# Altium schematic sheet 3_接口.schdoc.schdoc
size 309 x 223 mm; Symbol: Sheet-Symbol_A4; Device: Sheet-Symbol_A4; Company: 嘉立创EDA; Drawed: 吴登珂; Version: V1.0; Page Size: A4; @Project Name: 最小系统板; @Page Count: 3; @Update Date: 2024-04-14; @Create Date: 2024-04-05; @Schematic Name: Schematic1; @Page No: 2; @Page Name: 接口
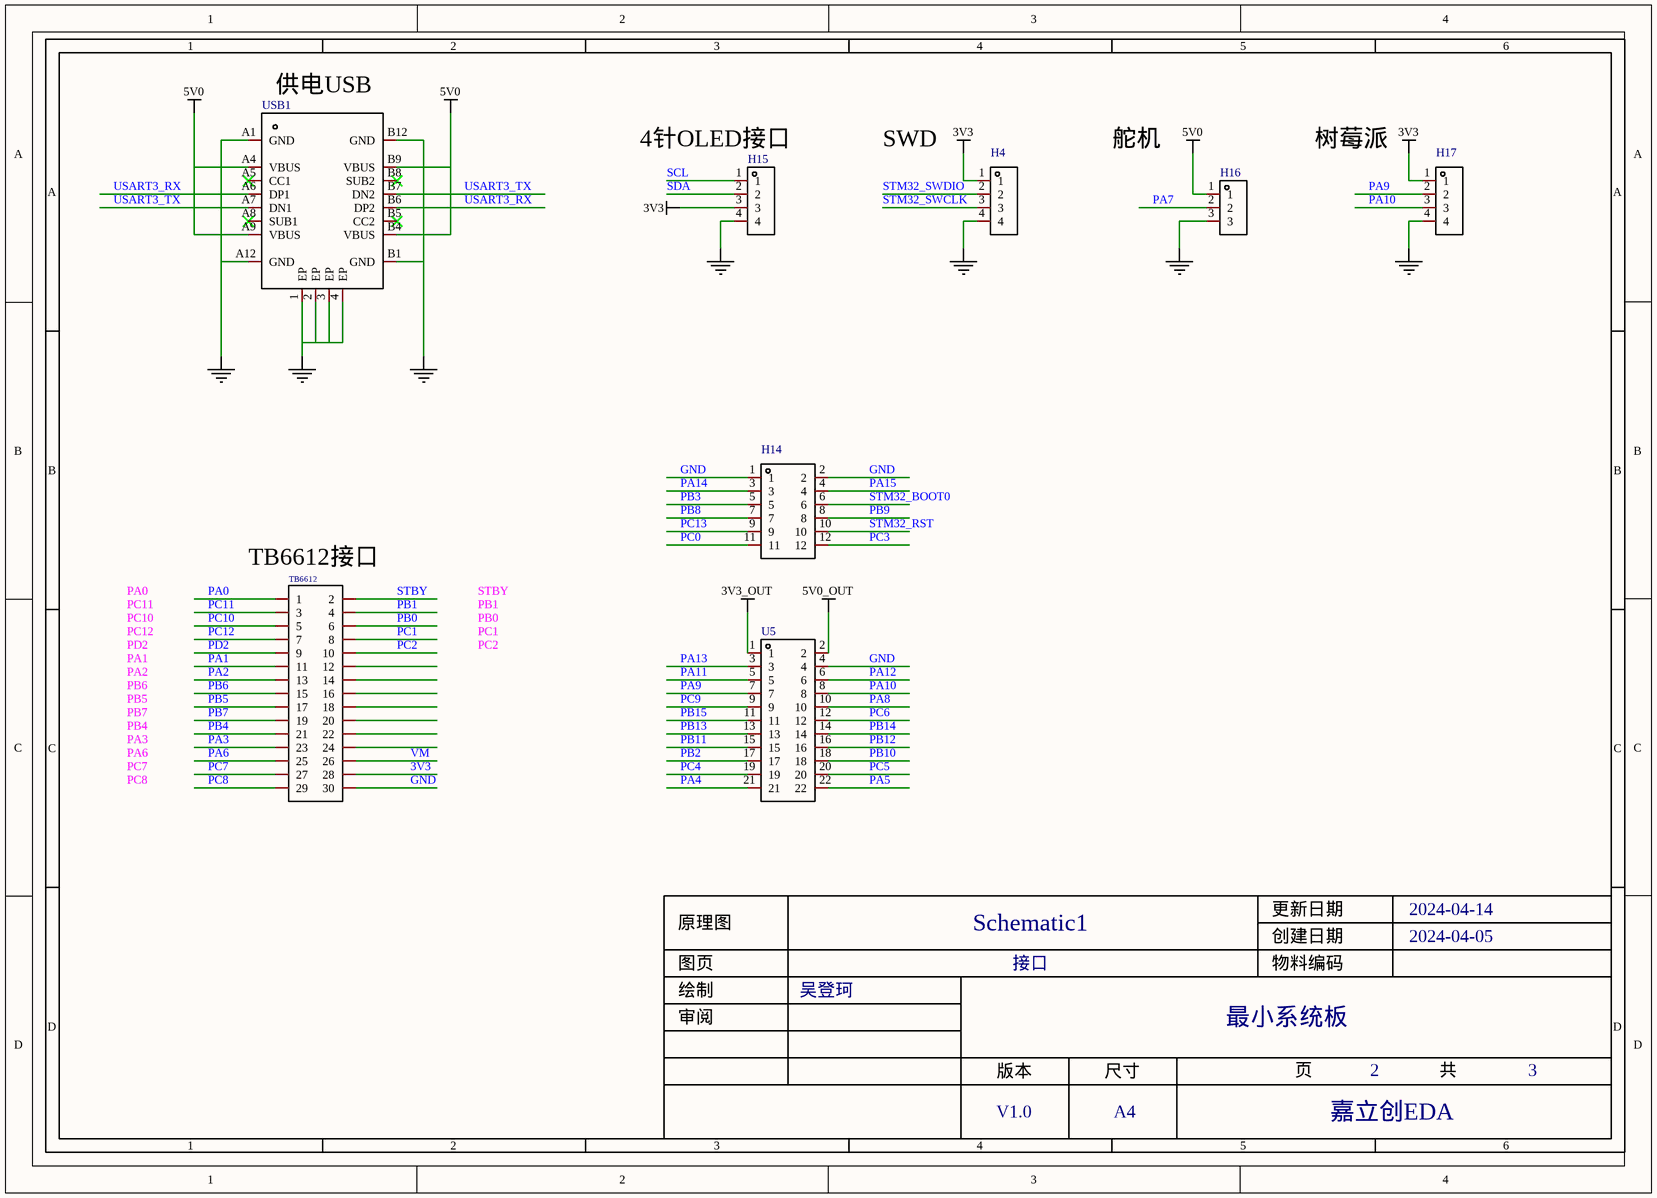
[diagram p0: 3_接口.schdoc.schdoc]

## Parts
H4  PZ254V-11-04P  [HDR-TH_4P-P2.54-V-M]  (value not drawn)
H14  HDR-M_2.54_2x6  [HDR-TH_12P-P2.54-V-M-R2-C6-S2.54]  (value not drawn)
H15  HDR-M_2.54_1x4P  [HDR-TH_4P-P2.54-V-M]  (value not drawn)
H16  HDR-F_2.54_1x3P  [HDR-TH_3P-P2.54-V-F]  (value not drawn)
H17  HDR-F_2.54_1x4P  [HDR-TH_4P-P2.54-V-F]  (value not drawn)
TB6612  2.54-2*15P双排针  [HDR-TH_30P-P2.54-V-M-R2-C15-S2.54]  (value not drawn)
U5  PM254-2-11-Z-8.5  [HDR-TH_22P-P2.54-V-F-R2-C11-S2.54]  (value not drawn)
USB1  KH-TYPE-C-16P  [USB-C-SMD_KH-TYPE-C-16P]  (value not drawn)

## Nets
3V3: H4.1 H15.3 H17.1 TB6612.28
3V3_OUT: U5.1
5V0: H16.1 USB1.A4(VBUS) USB1.A9(VBUS) USB1.B4(VBUS) USB1.B9(VBUS)
5V0_OUT: U5.2
NetH4_4: H4.4 H15.4 H16.3 H17.4 USB1.1(EP) USB1.2(EP) USB1.3(EP) USB1.4(EP) USB1.A1(GND) USB1.A12(GND) USB1.B1(GND) USB1.B12(GND)
GND: H14.1 H14.2 TB6612.30 U5.4
PA0: TB6612.1
PA1: TB6612.11
PA2: TB6612.13
PA3: TB6612.23
PA4: U5.21
PA5: U5.22
PA6: TB6612.25
PA7: H16.2
PA8: U5.10
PA9: H17.2 U5.7
PA10: H17.3 U5.8
PA11: U5.5
PA12: U5.6
PA13: U5.3
PA14: H14.3
PA15: H14.4
PB0: TB6612.6
PB1: TB6612.4
PB2: U5.17
PB3: H14.5
PB4: TB6612.21
PB5: TB6612.17
PB6: TB6612.15
PB7: TB6612.19
PB8: H14.7
PB9: H14.8
PB10: U5.18
PB11: U5.15
PB12: U5.16
PB13: U5.13
PB14: U5.14
PB15: U5.11
PC0: H14.11
PC1: TB6612.8
PC2: TB6612.10
PC3: H14.12
PC4: U5.19
PC5: U5.20
PC6: U5.12
PC7: TB6612.27
PC8: TB6612.29
PC9: U5.9
PC10: TB6612.5
PC11: TB6612.3
PC12: TB6612.7
PC13: H14.9
PD2: TB6612.9
SCL: H15.1
SDA: H15.2
STBY: TB6612.2
STM32_BOOT0: H14.6
STM32_RST: H14.10
STM32_SWCLK: H4.3
STM32_SWDIO: H4.2
USART3_RX: USB1.A6(DP1) USB1.B6(DP2)
USART3_TX: USB1.A7(DN1) USB1.B7(DN2)
VM: TB6612.26

Not connected (* = marked no-connect by the designer): TB6612 12 14 16 18 20 22 24; USB1 A5(CC1)* A8(SUB1)* B5(CC2)* B8(SUB2)*

## Notes on the sheet
- (near USB1) 供电USB
- (near H15) 4针OLED接口
- SWD
- 舵机
- 树莓派
- PA0
- PC11
- (near TB6612) TB6612接口
- PB1
- STBY
- PA1
- PA2
- PC10
- PC12
- PD2
- PB0
- PC1
- PC2
- PA3
- PB5
- PB6
- PB7
- PB4
- PA6
- PC7
- PC8
- 1
- 2
- 3
- 4
- 5
- 6
- A
- B
- C
- 原理图
- Schematic1
- 创建日期
- 更新日期
- 2024-04-14
- 2024-04-05
- 审阅
- 绘制
- 图页
- 吴登珂
- 接口
- 物料编码
- 最小系统板
- D
- 版本
- 尺寸
- 页
- 共
- V1.0
- A4
- 嘉立创EDA

## Library data of the parts
H4 = PZ254V-11-04P: Manufacturer: XFCN(兴飞); Symbol: PZ254V-11-04P_C2691448; Add into BOM: yes; Pin Structure: 1x4P; Pitch: 2.54mm; Circluar Pins/Square Pins: 方针; Current Rating (Max): 3A; Voltage Rating (Max): 250V; Description: 插针结构:1x4P;间距:2.54mm;行距:-;圆针/方针:方针;安装类型:直插;排数:单排;总PIN位数:4P;额定电流:3A;额定电压:250V;配合针长度:6mm;塑高:2.5mm;端接针长度:3mm;触头材质:-;工作温度范围:-40℃~+105℃;颜色:黑色;; Name: PZ254V-11-04P; Device: PZ254V-11-04P; Supplier: LCSC; Supplier Part: C2691448; Manufacturer Part: PZ254V-11-04P; JLCPCB Part Class: 扩展库; LCSC Part Name: 间距:2.54mm 1x4P 直插 方针; Supplier Footprint: 插件,P=2.54mm; Datasheet: https://atta.szlcsc.com/upload/public/pdf/source/20200309/C492403_F9F19131791D08044AD4F84F8E751A34.pdf; Convert to PCB: yes; Row Spacing: -; Mounting Type: 直插; Number of Rows: 单排; Number of Pins: 4P; Length of Mating Pin: 6mm; Insulation Height: 2.5mm; Length of End Connection Pin: 3mm; Contact Material: -; Operating Temperature Range: -40℃~+105℃; Color: 黑色
H14 = HDR-M_2.54_2x6: Symbol: HDR-M-2.54_2x6; Convert to PCB: yes; Device: HDR-M_2.54_2x6; Add into BOM: yes; Supplier Part: C30734; Supplier Footprint: 插件,P=2.54mm
H15 = HDR-M_2.54_1x4P: Symbol: PZ254V-11-04P; Convert to PCB: yes; Device: HDR-M_2.54_1x4P; Add into BOM: yes; Supplier Part: C492403; Supplier Footprint: 插件
H16 = HDR-F_2.54_1x3P: Symbol: PM254V-11-03-H85; Convert to PCB: yes; Device: HDR-F_2.54_1x3P; Add into BOM: yes; Supplier Part: C541850; Supplier Footprint: 插件
H17 = HDR-F_2.54_1x4P: Manufacturer: BOOMELE(博穆精密); Symbol: 2.54-1*4P母; Convert to PCB: yes; Device: HDR-F_2.54_1x4P; Supplier: LCSC; Supplier Part: C2718488; Manufacturer Part: 2.54-1*4P母; JLCPCB Part Class: Extended Part; Add into BOM: yes; Supplier Footprint: 插件
TB6612 = 2.54-2*15P双排针: Manufacturer: BOOMELE(博穆精密); Symbol: Header-Male-2.54_2x15; Add into BOM: yes; Pin Structure: 2x15P; Pitch: 2.54mm; Circluar Pins/Square Pins: 方针; Current Rating (Max): 3A; Description: 插针结构:2x15P;间距:2.54mm;行距:2.54mm;圆针/方针:方针;安装类型:直插;排数:双排;总PIN位数:30P;额定电流:3A;额定电压:-;配合针长度:6mm;塑高:-;端接针长度:3mm;触头材质:黄铜;触头镀层:-;工作温度范围:-40℃~+105℃;颜色:黑色;; Name: 2.54-2*15P双排针; Device: 2.54-2*15P双排针; Supplier: LCSC; Manufacturer Part: 2.54-2*15P双排针; Supplier Part: C56496; JLCPCB Part Class: 扩展库; LCSC Part Name: 间距:2.54mm 2x15P 直插 方针; Supplier Footprint: 插件,P=2.54mm; Datasheet: https://atta.szlcsc.com/upload/public/pdf/source/20151109/1457707572823.pdf; Convert to PCB: yes; Row Spacing: 2.54mm; Mounting Type: 直插; Number of Rows: 双排; Number of Pins: 30P; Voltage Rating (Max): -; Length of Mating Pin: 6mm; Insulation Height: -; Length of End Connection Pin: 3mm; Contact Material: 黄铜; Contact Plating: -; Operating Temperature Range: -40℃~+105℃; Color: 黑色
U5 = PM254-2-11-Z-8.5: Manufacturer: HCTL(华灿天禄); Add into BOM: yes; Holes Structure: 2x11P; Pitch: 2.54mm; Circular Hole / Square Hole: 方孔; Number of Holes: 22P; Current Rating (Max): 3A; Holes Direction: 顶部; Soldering Temperature(Max): 260℃@5S; Description: 插孔结构:2x11P;间距:2.54mm;行距:2.54mm;圆孔/方孔:方孔;安装类型:直插;排数:双排;总孔位数:22P;额定电流:3A;额定电压:-;插孔方向:顶部;塑高:8.5mm;触头材质:铜合金;工作温度范围:-40℃~+105℃;焊接温度(最大值):260℃@5S;; Name: PM254-2-11-Z-8.5; Symbol: PM254-2-11-Z-8.5; Device: PM254-2-11-Z-8.5; LCSC Part Name: 2x11P 间距:2.54mm 直插; Supplier Part: C2897412; Manufacturer Part: PM254-2-11-Z-8.5; Supplier Footprint: 插件,P=2.54mm; JLCPCB Part Class: 扩展库; Datasheet: https://atta.szlcsc.com/upload/public/pdf/source/20230609/3D36CA2C1BFC9FD1C3F709AD9DFEB9C2.pdf; Supplier: LCSC; Convert to PCB: yes; Row Spacing: 2.54mm; Mounting Type: 直插; Number of Rows: 双排; Voltage Rating (Max): -; Insulation Height: 8.5mm; Contact Material: 铜合金; Operating Temperature Range: -40℃~+105℃
USB1 = KH-TYPE-C-16P: Manufacturer: kinghelm(金航标); Add into BOM: yes; Connector Type: Type-C; Gender: 母; Number of Ports: 1; Number of Contacts: 16P; Current Rating - Power (Max): 3A; Description: 连接器类型:Type-C;标准:-;公母:母;端口数量:1;触点数量:16P;安装方式:卧贴;额定电流 - 电源:3A;工作温度范围:-40℃~+85℃;; Name: KH-TYPE-C-16P; Symbol: KH-TYPE-C-16P; Device: KH-TYPE-C-16P; LCSC Part Name: Type-C 母 卧贴; Supplier Part: C709357; Manufacturer Part: KH-TYPE-C-16P; Supplier Footprint: SMD; JLCPCB Part Class: 扩展库; Datasheet: https://atta.szlcsc.com/upload/public/pdf/source/20200911/C709357_AA8DCEB38BB20E3035A7ED7AE7667837.pdf; Supplier: LCSC; Convert to PCB: yes; Standard: -; Mounting Style: 卧贴; Operating Temperature Range: -40℃~+85℃